# EasyEDA Pro project 连接板.epro

# Schematic Schematic1
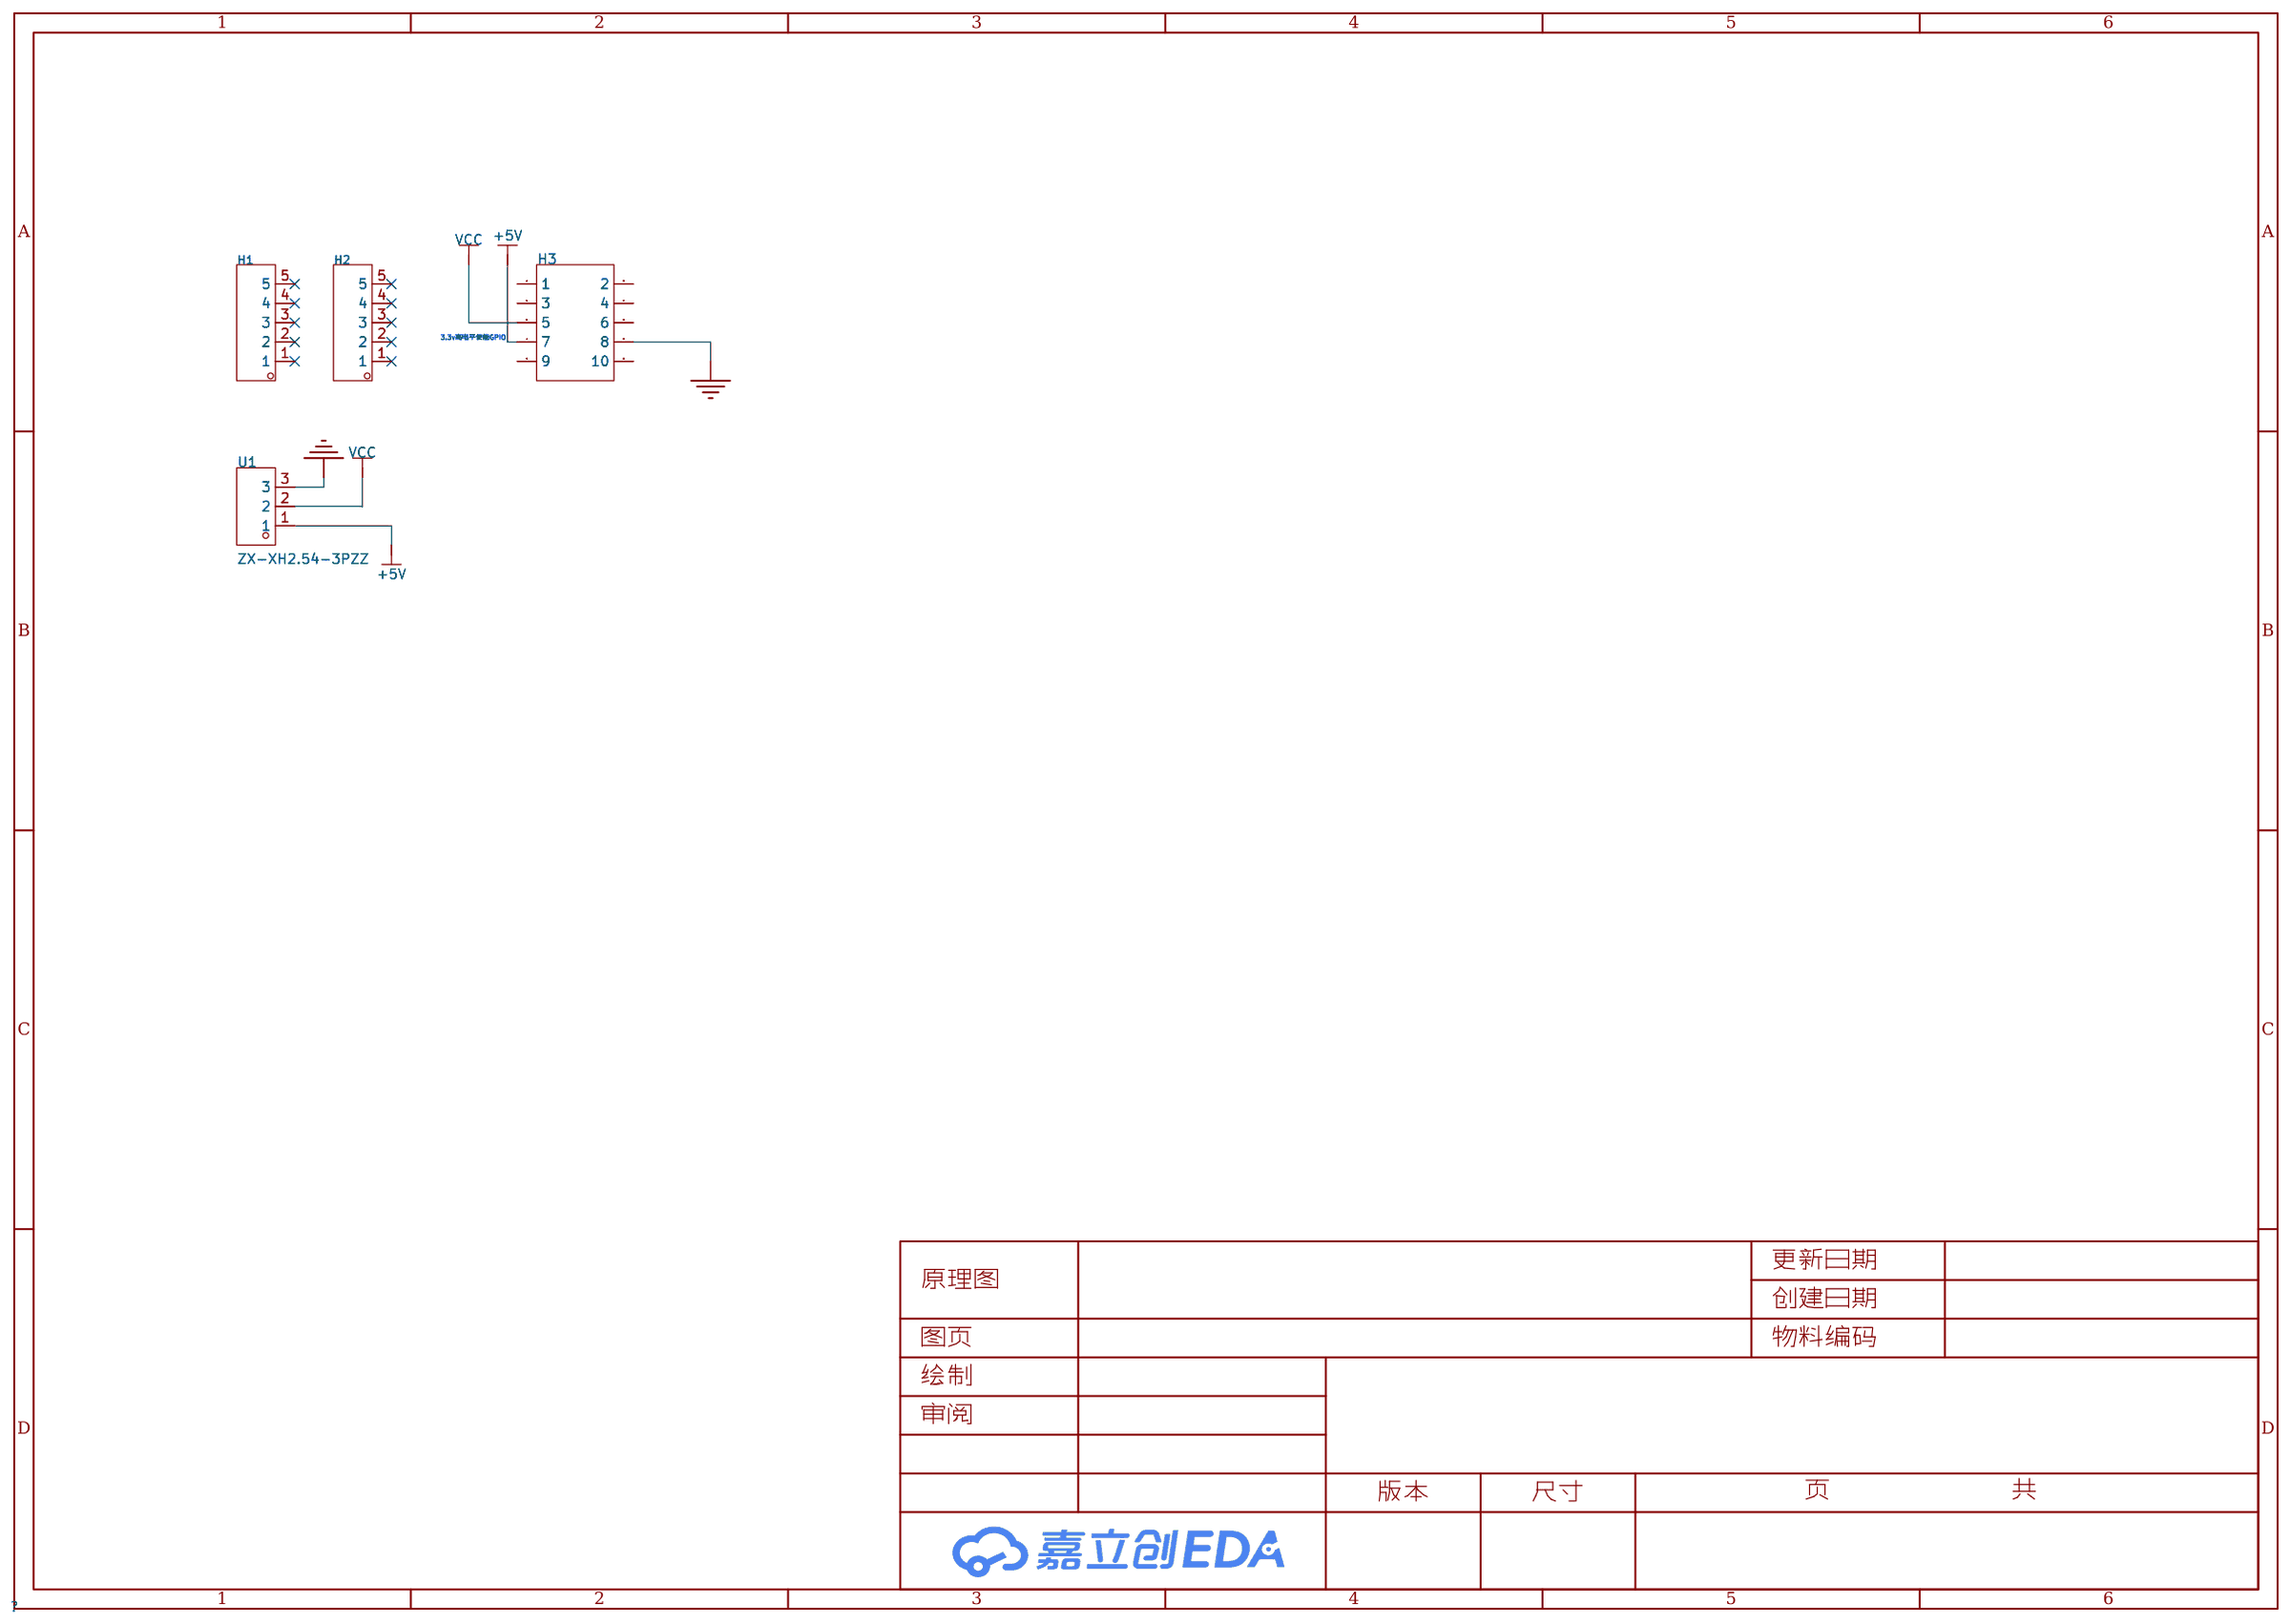
[diagram p0: schematic sheet]

## Parts
H1  -  [HDR-TH_5P-P2.54-V-M]
H2  -  [HDR-TH_5P-P2.54-V-M]
H3  -  [HDR-TH_10P-P2.54-V-F-R2-C5-S2.54]
U1  ZX-XH2.54-3PZZ  [CONN-TH_3P-P2.54_2501S-3P]

## Library data of the parts
H1 H2 = HDR-M_2.54_1x5P: Supplier Part: C358687; Supplier Footprint: 插件
H3 = HDR-F_2.54_2x5: Supplier Part: C92270; Supplier Footprint: 插件
U1 = ZX-XH2.54-3PZZ: 插针结构:1x3P;间距:2.54mm;安装方式:直插;参考系列:XH;总PIN数:3P;排数:1;每排PIN数:3;行距:-;额定电流:3A;触头材质:黄铜;触头镀层:锡;工作温度范围:-25℃~+85℃;; Supplier Part: C7429633; Manufacturer: Megastar(兆星); Supplier Footprint: 插件,P=2.54mm; JLCPCB Part Class: 扩展库; Datasheet: https://atta.szlcsc.com/upload/public/pdf/source/20230619/AE17037A2CFDBE8D9CBA775D61AD0A84.pdf; Supplier: LCSC; Pins Structure: 1x3P; Pitch: 2.54mm; Mounting Style: 直插; Reference Series: XH; Number of Pins: 3P; Number of Rows: 1; Number of PINs Per Row: 3; Current Rating (Max): 3A; Contact Material: 黄铜; Contact Plating: 锡; Operating Temperature Range: -25℃~+85℃

## Nets
+5V: H3.7 U1.1
GND: H3.8 U1.3
VCC: H3.5 U1.2

Not connected (* = marked no-connect by the designer): H1 1* 2* 3* 4* 5*; H2 1* 2* 3* 4* 5*; H3 1 2 3 4 6 9 10

## Notes on the sheet
- 3.3v高电平使能GPIO
